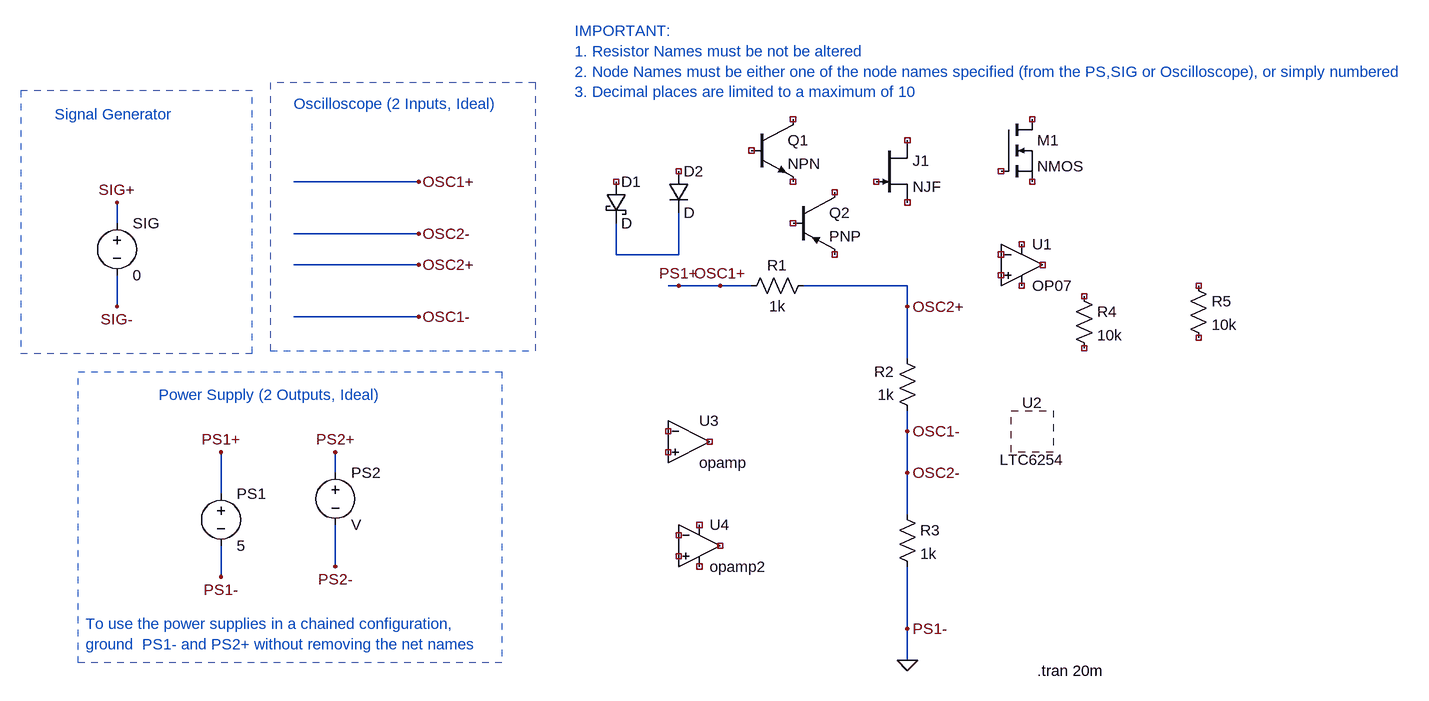
[diagram p0: schematic 5.asc]
5.asc, the LTspice schematic file:
Version 4
SHEET 1 2020 680
WIRE 512 -304 320 -304
WIRE 48 -240 48 -272
WIRE 512 -224 320 -224
WIRE 816 -192 816 -240
WIRE 912 -192 912 -256
WIRE 912 -192 816 -192
WIRE 512 -176 320 -176
WIRE 912 -144 896 -144
WIRE 976 -144 912 -144
WIRE 1024 -144 976 -144
WIRE 1264 -144 1104 -144
WIRE 48 -112 48 -160
WIRE 1264 -112 1264 -144
WIRE 512 -96 320 -96
WIRE 1264 -32 1264 -112
WIRE 1264 80 1264 48
WIRE 384 144 384 112
WIRE 1264 144 1264 80
WIRE 208 176 208 112
WIRE 1264 208 1264 144
WIRE 384 288 384 224
WIRE 208 304 208 256
WIRE 1264 384 1264 288
WIRE 1264 432 1264 384
FLAG 512 -176 OSC2+
FLAG 512 -96 OSC1-
FLAG 512 -304 OSC1+
FLAG 512 -224 OSC2-
FLAG 48 -272 SIG+
FLAG 48 -112 SIG-
FLAG 208 112 PS1+
FLAG 384 112 PS2+
FLAG 208 304 PS1-
FLAG 384 288 PS2-
FLAG 912 -144 PS1+
FLAG 976 -144 OSC1+
FLAG 1264 -112 OSC2+
FLAG 1264 432 0
FLAG 1264 80 OSC1-
FLAG 1264 144 OSC2-
FLAG 1264 384 PS1-
SYMBOL voltage 208 160 R0
SYMATTR InstName PS1
SYMATTR Value 5
SYMBOL voltage 384 128 R0
SYMATTR InstName PS2
SYMBOL voltage 48 -256 R0
SYMATTR InstName SIG
SYMATTR Value 0
SYMBOL res 1120 -160 R90
WINDOW 0 0 56 VBottom 2
WINDOW 3 32 56 VTop 2
SYMATTR InstName R1
SYMATTR Value 1k
SYMBOL res 1280 64 R180
WINDOW 0 36 76 Left 2
WINDOW 3 36 40 Left 2
SYMATTR InstName R2
SYMATTR Value 1k
SYMBOL res 1248 192 R0
SYMATTR InstName R3
SYMATTR Value 1k
SYMBOL res 1520 -144 R0
SYMATTR InstName R4
SYMATTR Value 10k
SYMBOL res 1696 -160 R0
SYMATTR InstName R5
SYMATTR Value 10k
SYMBOL npn 1024 -400 R0
SYMATTR InstName Q1
SYMBOL schottky 800 -304 R0
SYMATTR InstName D1
SYMBOL diode 896 -320 R0
SYMATTR InstName D2
SYMBOL njf 1216 -368 R0
SYMATTR InstName J1
SYMBOL nmos 1408 -400 R0
SYMATTR InstName M1
SYMBOL pnp 1088 -288 R0
SYMATTR InstName Q2
SYMBOL OpAmps/OP07 1440 -240 R0
SYMATTR InstName U1
SYMBOL OpAmps/LTC6254 1456 80 R0
SYMATTR InstName U2
SYMBOL OpAmps/opamp 928 32 R0
SYMATTR InstName U3
SYMBOL OpAmps/opamp2 944 192 R0
SYMATTR InstName U4
TEXT -48 -408 Left 2 ;Signal Generator
TEXT 320 -424 Left 2 ;Oscilloscope (2 Inputs, Ideal)
TEXT 112 24 Left 2 ;Power Supply (2 Outputs, Ideal)
TEXT 0 376 Left 2 ;To use the power supplies in a chained configuration, \nground  PS1- and PS2+ without removing the net names
TEXT 1464 448 Left 2 !.tran 20m
TEXT 752 -536 Left 2 ;IMPORTANT:\n1. Resistor Names must be not be altered\n2. Node Names must be either one of the node names specified (from the PS,SIG or Oscilloscope), or simply numbered\n3. Decimal places are limited to a maximum of 10
RECTANGLE Normal -12 -12 640 436 2
RECTANGLE Normal -100 -40 256 -444 2
RECTANGLE Normal 284 -44 692 -456 2

The netlist it stands for:
* 5.asc
V§PS1 PS1+ 0 5
V§PS2 PS2+ PS2- V
V§SIG SIG+ SIG- 0
R1 OSC2+ PS1+ 1k
R2 OSC2- OSC2+ 1k
R3 OSC2- 0 1k
R4 NC_01 NC_02 10k
R5 NC_03 NC_04 10k
Q1 NC_05 NC_06 NC_07 0 NPN
D1 NC_08 N001 D
D2 NC_09 N001 D
J1 NC_10 NC_11 NC_12 NJF
M1 NC_13 NC_14 NC_15 NC_15 NMOS
Q2 NC_16 NC_17 NC_18 0 PNP
XU1 NC_19 NC_20 NC_21 NC_22 NC_23 LT1001  ; OP07, pins In+ In- V+ V- OUT
* U2: LTC6254 (symbol OpAmps/LTC6254 not available, pin order unknown); nets seen at it: 
XU3 NC_24 NC_25 NC_26 opamp Aol=100K GBW=10Meg  ; pins invin noninvin out
XU4 NC_27 NC_28 NC_29 NC_30 NC_31 opamp2  ; pins In+ In- V+ V- OUT
.model D D
.lib standard.dio
.model NPN NPN
.model PNP PNP
.lib standard.bjt
.model NJF NJF
.model PJF PJF
.lib standard.jft
.model NMOS NMOS
.model PMOS PMOS
.lib standard.mos
* Signal Generator
* Oscilloscope (2 Inputs, Ideal)
* Power Supply (2 Outputs, Ideal)
* To use the power supplies in a chained configuration,
* ground  PS1- and PS2+ without removing the net names
.tran 20m
* IMPORTANT:
* 1. Resistor Names must be not be altered
* 2. Node Names must be either one of the node names specified (from the PS,SIG or Oscilloscope), or simply numbered
* 3. Decimal places are limited to a maximum of 10
.lib LTC.lib
.backanno
.end